# Altium schematic sheet LV_power.SchDoc
size Letter; DrawnBy: Robson Souza; SheetNumber: 7; SheetTotal: 9
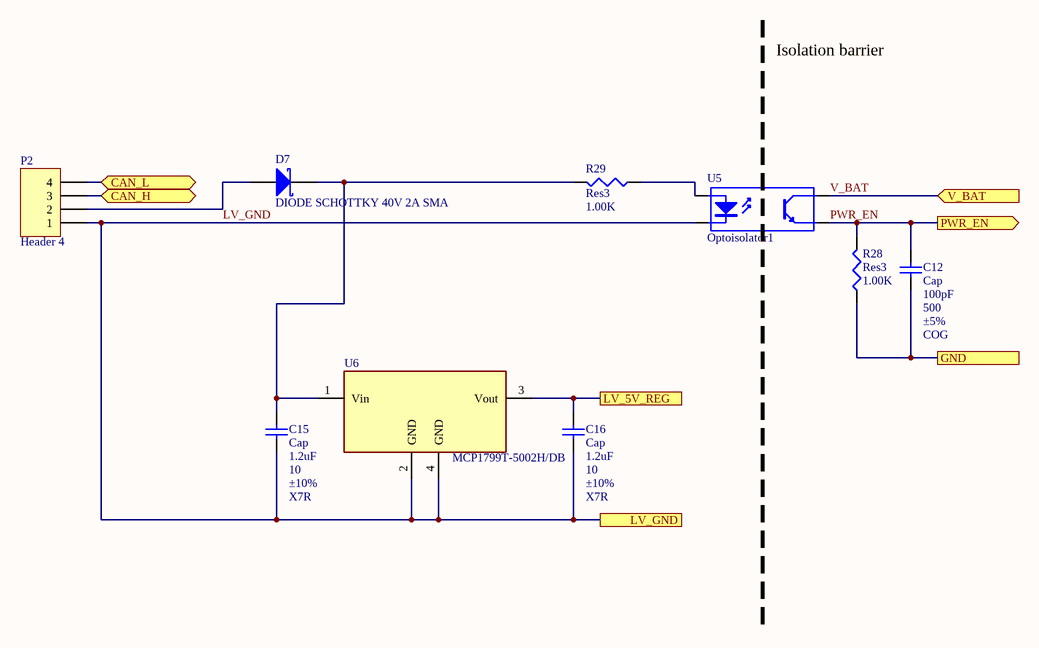
[diagram p0: LV_power.SchDoc]

## Parts
C12  Cap  value 100pF  WV: 500  Tolerance: ±5%  Type: COG  [CAPC2012X09M]
C15  Cap  value 1.2uF  WV: 10  Tolerance: ±10%  Type: X7R  [CAPC2012X09M]
C16  Cap  value 1.2uF  WV: 10  Tolerance: ±10%  Type: X7R  [CAPC2012X09M]
D7  DIODE SCHOTTKY 40V 2A SMA  [DIOM4326X23M]
P2  Header 4  [HDR1X4]
R28  Res3  value 1.00K  [RESC2112X05M]
R29  Res3  value 1.00K  [RESC2112X05M]
U5  Optoisolator1  [DIP-4]
U6  MCP1799T-5002H/DB  [SOT223]

## Ports
CAN_H (bidir), CAN_L (bidir), GND, LV_5V_REG, LV_GND, PWR_EN (out), V_BAT (in)

## Nets
CAN_H: P2.3 ; port CAN_H
CAN_L: P2.4 ; port CAN_L
GND: C12.1 R28.1 ; port GND
LV_5V_REG: C16.2 U6.3(Vout) ; port LV_5V_REG
LV_GND: C15.1 C16.1 P2.1 U5.2(K) U6.2(GND) U6.4(GND) ; port LV_GND
PWR_EN: C12.2 R28.2 U5.3(E) ; port PWR_EN
V_BAT: U5.4(C) ; port V_BAT
NetC15_2: C15.2 D7.1(K) R29.2 U6.1(Vin)
NetD7_2: D7.2(A) P2.2
NetR29_1: R29.1 U5.1(A)

## Notes on the sheet
- Isolation barrier

## Library data of the parts
C12 = CAP-COG-100pF-500V-±5%: CAP CER 100pF 500v COG 0805; MPN: C0805C101JCGACTU; PN: 399-5102-1-ND; Name: CAP-COG-100pF-500V-±5%; URL: http://www.digikey.ca/product-detail/en/C0805C101JCGACTU/399-5102-1-ND
C15 C16 = CAP-X7R-1.2uF-10V-±10%: CAP CER 1.2uF 10v X7R 0805; MPN: C0805C125K8RACTU; PN: 399-4928-1-ND; Name: CAP-X7R-1.2uF-10V-±10%; URL: http://www.digikey.ca/product-detail/en/C0805C125K8RACTU/399-4928-1-ND
D7 = DIODE SCHOTTKY 40V 2A SMA: Schottky Rectifier; MPN: B240A-13-F; PN: B240A-FDICT-ND; URL: http://www.digikey.ca/product-detail/en/B240A-13-F/B240A-FDICT-ND
P2 = Header 4: Header, 4-Pin; LatestRevisionDate: 17-Jul-2002; LatestRevisionNote: Re-released for DXP Platform.; Publisher: Altium Limited
R28 R29 = Resistor_1.00K: RES SMD 1.00K OHM 1% 1/8W 0805; MPN: CRCW08051K00FKEA; PN: 541-1.00KCCT-ND; Name: Resistor_1.00K; URL: http://www.digikey.ca/product-detail/en/CRCW08051K00FKEA/541-1.00KCCT-ND
U5 = Optoisolator1: 4-Pin Phototransistor Optocoupler; Published: 24-Mar-1999; LatestRevisionDate: 04-Mar-2005; LatestRevisionNote: Sch pins 3 & 4 Swapped.; DatasheetVersion: Nov-2003; PackageReference: DIP-4; Publisher: Altium Limited
U6 = LM1117IMP-5.0: LDO 5V 80mA SOT-223; MF: Texas Instruments; Availability: Bad; SnapEDA_Link: https://www.snapeda.com/parts/LM1117IMP-5.0/Texas%20Instruments/view-part/4449502/?ref=snap; Price: None; Check_prices: https://www.snapeda.com/parts/LM1117IMP-5.0/Texas%20Instruments/view-part/4449502/?ref=eda; Package: SOT-223 Texas Instruments; Purchase-URL: https://pricing.snapeda.com/search/part/LM1117IMP-5.0/?ref=eda; MP: LM1117IMP-5.0; Value: *